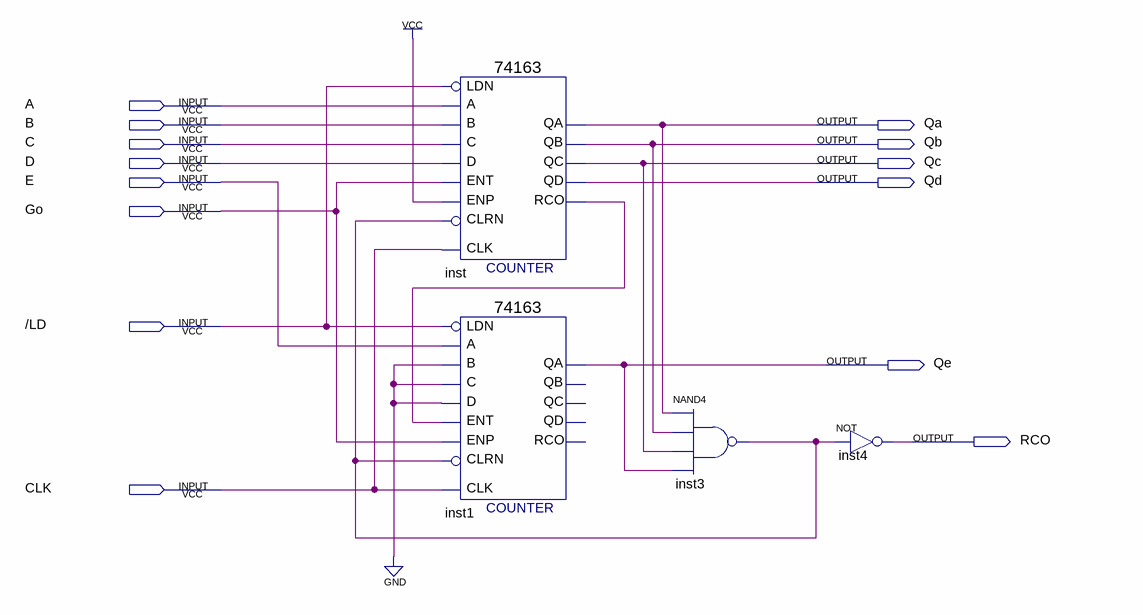
[diagram p0: schematic sheet]
// Quartus schematic mod24.bdf as structural Verilog: 4 symbols, 14 pins
module mod24 (
  input  A,
  input  B,
  input  C,
  input  D,
  input  E,
  input  Go,
  input  \/LD ,
  input  CLK,
  output Qa,
  output Qb,
  output Qc,
  output Qd,
  output Qe,
  output RCO
);

  wire inst3_out, inst_rco;

  \74163  inst (
    .C(C), .B(B), .A(A), .ENT(Go), .D(D), .CLRN(inst3_out), .CLK(CLK), .ENP(1'b1), .LDN(\/LD ), .QA(Qa),
    .QB(Qb), .QC(Qc), .QD(Qd), .RCO(inst_rco));
  \74163  inst1 (
    .C(1'b0), .B(1'b0), .A(E), .ENT(inst_rco), .D(1'b0), .CLRN(inst3_out), .CLK(CLK), .ENP(Go), .LDN(\/LD ),
    .QA(Qe));  // open: QB, QC, QD, RCO
  nand inst3 (inst3_out, Qa, Qb, Qc, Qe);
  not inst4 (RCO, inst3_out);
endmodule
